# Altium project Motherboard_Cube.PrjPCB
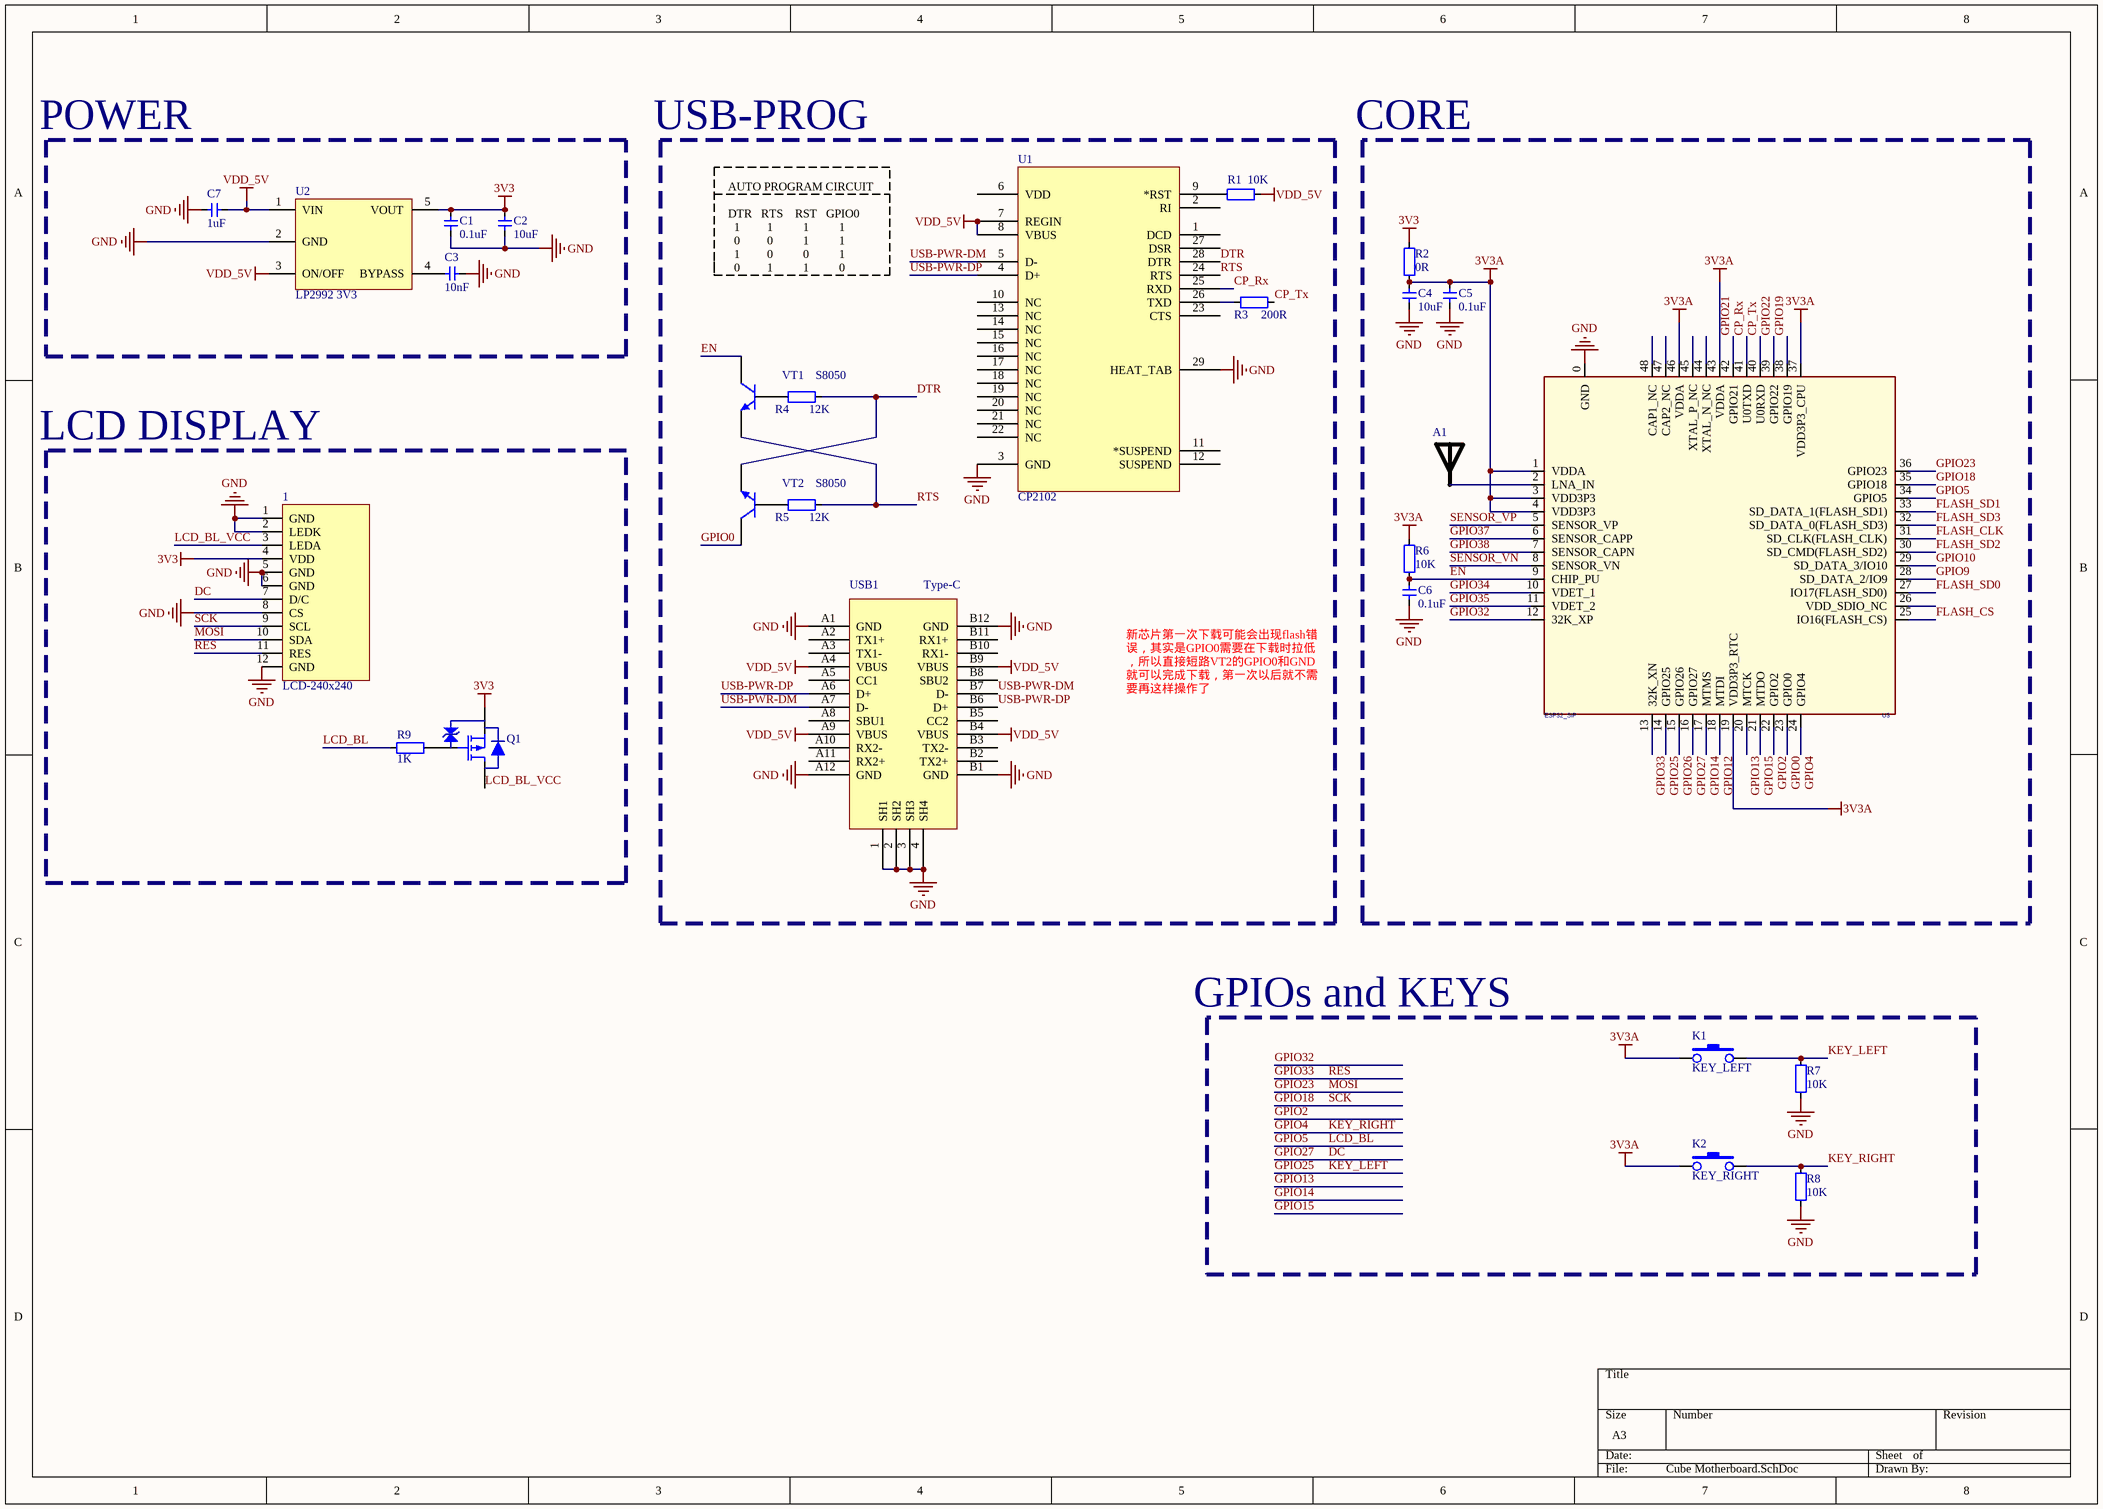
[diagram p0: Cube Motherboard.SchDoc]
1 sheet, 27 parts. Net scope: global (net labels, ports and power ports of the same name join across sheets).
Board file: Motherboard_Cube.PcbDoc

## Sheet Cube Motherboard.SchDoc
size A3

### Parts
1  LCD-240x240  [LCD-240X240-NOHOLE]
A1  RAINSUN  [ANT-Rainsun-AN5120]  (value not drawn)
C1  0.1uF  [0603C]
C2  10uF  [0603C]
C3  10nF  [0603C]
C4  10uF  [0603C]
C5  0.1uF  [0603C]
C6  0.1uF  [0603C]
C7  1uF  [0603C]
K1  KEY_LEFT  [SMD-SW2X4]
K2  KEY_RIGHT  [SMD-SW2X4]
Q1  AO3415A  [SOT23-3]  (value not drawn)
R1  10K  [0603R]
R2  0R  [0603R]
R3  200R  [0603R]
R4  12K  [0603R]
R5  12K  [0603R]
R6  10K  [0603R]
R7  10K  [0603R]
R8  10K  [0603R]
R9  1K  [0603R]
U1  CP2102  [QFN-28]
U2  LP2992 3V3  [SOT23-5]
U3  ESP32_SIP  [QFN-48_7X7]
USB1  Type-C  [Type-C-TOP]
VT1  S8050  [SMT_TRIODE_NPN]
VT2  S8050  [SMT_TRIODE_NPN]

### Nets
3V3: 1.4(VDD) C1.2 C2.2 Q1.2(S) R2.1 U2.5(VOUT)
3V3A: C4.2 C5.2 K1.1 K2.1 R2.2 R6.1 U3.1(VDDA) U3.3(VDD3P3) U3.4(VDD3P3) U3.19(VDD3P3_RTC) U3.37(VDD3P3_CPU) U3.43(VDDA) U3.46(VDDA)
GND: 1.1(GND) 1.2(LEDK) 1.5(GND) 1.6(GND) 1.8(CS) 1.12(GND) C1.1 C2.1 C3.1 C4.1 C5.1 C6.2 C7.2 R7.2 R8.2 U1.3(GND) U1.29(HEAT_TAB) U2.2(GND) U3.0(GND) USB1.1(SH1) USB1.2(SH2) USB1.3(SH3) USB1.4(SH4) USB1.A1(GND) USB1.A12(GND) USB1.B1(GND) USB1.B12(GND)
VDD_5V: C7.1 R1.1 U1.7(REGIN) U1.8(VBUS) U2.1(VIN) U2.3(ON/OFF) USB1.A4(VBUS) USB1.A9(VBUS) USB1.B4(VBUS) USB1.B9(VBUS)
CP_Rx: U1.25(RXD) U3.41(U0TXD)
CP_Tx: R3.1 U3.40(U0RXD)
DC: 1.7(D/C) U3.16(GPIO27)  [also labelled GPIO27]
DTR: R4.1 U1.28(DTR) VT2.2(E)
EN: C6.1 R6.2 U3.9(CHIP_PU) VT1.3(C)
FLASH_CLK: U3.31(SD_CLK(FLASH_CLK))
FLASH_CS: U3.25(IO16(FLASH_CS))
FLASH_SD0: U3.27(IO17(FLASH_SD0))
FLASH_SD1: U3.33(SD_DATA_1(FLASH_SD1))
FLASH_SD2: U3.30(SD_CMD(FLASH_SD2))
FLASH_SD3: U3.32(SD_DATA_0(FLASH_SD3))
GPIO0: U3.23(GPIO0) VT2.3(C)
GPIO2: U3.22(GPIO2)
GPIO4: K2.3 R8.1 U3.24(GPIO4)  [also labelled KEY_RIGHT]
GPIO5: R9.1 U3.34(GPIO5)  [also labelled LCD_BL]
GPIO9: U3.28(SD_DATA_2/IO9)
GPIO10: U3.29(SD_DATA_3/IO10)
GPIO12: U3.18(MTDI)
GPIO13: U3.20(MTCK)
GPIO14: U3.17(MTMS)
GPIO15: U3.21(MTDO)
GPIO18: 1.9(SCL) U3.35(GPIO18)  [also labelled SCK]
GPIO19: U3.38(GPIO19)
GPIO21: U3.42(GPIO21)
GPIO22: U3.39(GPIO22)
GPIO23: 1.10(SDA) U3.36(GPIO23)  [also labelled MOSI]
GPIO25: K1.3 R7.1 U3.14(GPIO25)  [also labelled KEY_LEFT]
GPIO26: U3.15(GPIO26)
GPIO32: U3.12(32K_XP)
GPIO33: 1.11(RES) U3.13(32K_XN)  [also labelled RES]
GPIO34: U3.10(VDET_1)
GPIO35: U3.11(VDET_2)
GPIO37: U3.6(SENSOR_CAPP)
GPIO38: U3.7(SENSOR_CAPN)
LCD_BL_VCC: 1.3(LEDA) Q1.3(D)
RTS: R5.1 U1.24(RTS) VT1.2(E)
SENSOR_VN: U3.8(SENSOR_VN)
SENSOR_VP: U3.5(SENSOR_VP)
USB-PWR-DM: U1.5(D-) USB1.A7(D-) USB1.B7(D-)
USB-PWR-DP: U1.4(D+) USB1.A6(D+) USB1.B6(D+)
NetA1_1: A1.1 U3.2(LNA_IN)
NetC3_2: C3.2 U2.4(BYPASS)
NetQ1_1: Q1.1(G) R9.2
NetR1_2: R1.2 U1.9(*RST)
NetR3_2: R3.2 U1.26(TXD)
NetR4_2: R4.2 VT1.1(B)
NetR5_2: R5.2 VT2.1(B)

Not connected (* = marked no-connect by the designer): U1 1(DCD) 2(RI) 6(VDD) 10(NC) 11(*SUSPEND) 12(SUSPEND) 13(NC) 14(NC) 15(NC) 16(NC) 17(NC) 18(NC) 19(NC) 20(NC) 21(NC) 22(NC) 23(CTS) 27(DSR); U3 26(VDD_SDIO_NC) 44(XTAL_N_NC) 45(XTAL_P_NC) 47(CAP2_NC) 48(CAP1_NC); USB1 A2(TX1+) A3(TX1-) A5(CC1) A8(SBU1) A10(RX2-) A11(RX2+) B2(TX2+) B3(TX2-) B5(CC2) B8(SBU2) B10(RX1-) B11(RX1+)

### Notes on the sheet
- POWER
- USB-PROG
- CORE
- AUTO PROGRAM CIRCUIT
  DTR   RTS    RST   GPIO0
  1         1          1          1
  0         0          1          1
  1         0          0          1
  0         1          1          0
- LCD DISPLAY
- 新芯片第一次下载可能会出现flash错误，其实是GPIO0需要在下载时拉低，所以直接短路VT2的GPIO0和GND就可以完成下载，第一次以后就不需要再这样操作了
- GPIOs and KEYS

### Library data of the parts
1 = LCD-240x240: 显示屏
A1 = ANT-Rainsun-AP5120
C1-C7 = 电容-0402: Capacitor; Value: 0.1u
K1 K2 = KEY
Q1 = AO3415A: MOSFET; Published: 8-Jun-2000; LatestRevisionDate: 17-Jul-2002; LatestRevisionNote: Re-released for DXP Platform.; PackageVersion: 1995/1996; PackageReference: E3; Publisher: Altium Limited; PackageDescription: TO, Flat Index; 3 In-Line, Axial Leads; Body Dia. 4.6mm; Lead Dia. 0.5 mm (max)
R1-R9 = 电阻-0402: Resistor; Value: 22R
U1 = CP2102: USB转TTL; PART DESC: SINGLE-CHIP USB TO UART BRIDGE, QFN28, RoHS.; MFG #1: SILICON LABS; PART NUMBER: CP2102; Value: Value; RefDes: RefDes; Type: DEV
U2 = LP2992: LDO
U3 = ESP32-PICO
USB1 = USB-Type-C-TOP
VT1 VT2 = SMT_TRIODE_NPN: Surface mount NPN transistor, package SOT-23